# Altium schematic sheet input.SCHDOC
size B
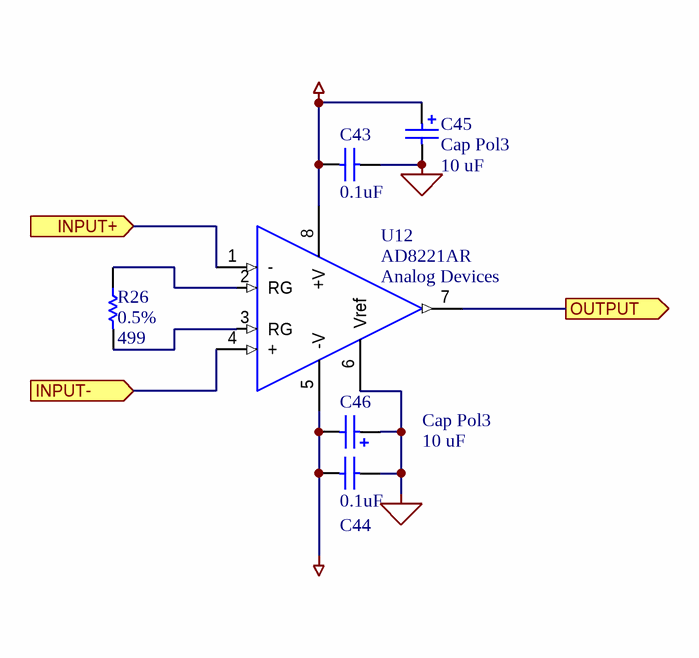
[diagram p0: input.SCHDOC]

## Parts
C43  value 0.1uF  [CC1608-0603]  (hidden comment: Cap)
C44  value 0.1uF  [CC1608-0603]  (hidden comment: Cap)
C45  Cap Pol3  value 10 uF  [TC3216-1206]
C46  Cap Pol3  value 10 uF  [TC3216-1206]
R26  0.5%  value 499  [CC1608-0603]
U12  AD8221AR  Vendor: Analog Devices  [SO-G8]

## Ports
INPUT+ (in), INPUT- (in), OUTPUT (out)

## Nets
AGND: C43.2 C44.2 C45.2 C46.1 U12.6(Vref)
AVDD: C43.1 C45.1 U12.8(+V)
AVSS: C44.1 C46.2 U12.5(-V)
INPUT+: U12.1(-) ; port INPUT+
INPUT-: U12.4(+) ; port INPUT-
OUTPUT: U12.7(Vout) ; port OUTPUT
NetR26_1: R26.1 U12.2(RG)
NetR26_2: R26.2 U12.3(RG)

## Library data of the parts
C43 C44 = Cap: Capacitor; Manufacturer: Generic Components; Class I: Passive; Published: 8-Jun-2000; Revision: July-2002: Re-released for DXP Platform.; Publisher: Altium Limited; Class II: Capacitor
C45 C46 = Cap Pol3: Polarized Capacitor (Surface Mount); Manufacturer: Generic Components; Class I: Passive; Published: 8-Jun-2000; Revision: July-2002: Re-released for DXP Platform.; Publisher: Altium Limited; Class II: Capacitor
R26 = Res1: RR1220P-4990-D-M; Manufacturer: Generic Components; Class I: Passive; Class II: Resistor; Published: 8-Jun-2000; Revision: July-2002: Re-released for DXP Platform.; Publisher: Altium Limited
U12 = AD8221: AD8221 Precision Instrumentation Amplifier